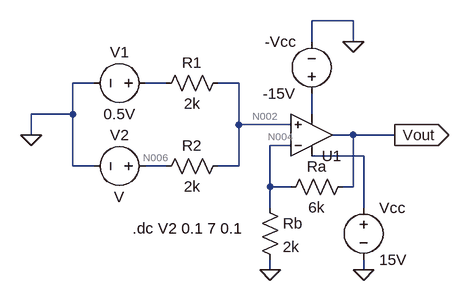
[diagram p0: schematic Q2.asc]
Q2.asc, the LTspice schematic file:
Version 4
SHEET 1 880 680
WIRE 256 -32 192 -32
WIRE 192 0 192 -32
WIRE 256 0 256 -32
WIRE -144 64 -176 64
WIRE -32 64 -64 64
WIRE 80 64 48 64
WIRE -176 112 -176 64
WIRE -176 112 -240 112
WIRE 192 112 192 80
WIRE 80 128 80 64
WIRE 160 128 80 128
WIRE -240 144 -240 112
WIRE 256 144 224 144
WIRE 320 144 256 144
WIRE 160 160 128 160
WIRE 272 176 192 176
WIRE -176 192 -176 112
WIRE -144 192 -176 192
WIRE -32 192 -64 192
WIRE 80 192 80 128
WIRE 80 192 48 192
WIRE 128 224 128 160
WIRE 160 224 128 224
WIRE 256 224 256 144
WIRE 256 224 240 224
WIRE 128 256 128 224
WIRE 272 256 272 176
WIRE 128 352 128 336
WIRE 272 352 272 336
FLAG 128 352 0
FLAG 256 0 0
FLAG 272 352 0
FLAG 320 144 Vout
IOPIN 320 144 Out
FLAG -240 144 0
SYMBOL Opamps\\UniversalOpamp2 192 144 M180
SYMATTR InstName U1
SYMBOL res 64 48 R90
WINDOW 0 0 56 VBottom 2
WINDOW 3 32 56 VTop 2
SYMATTR InstName R1
SYMATTR Value 2k
SYMBOL res 64 176 R90
WINDOW 0 0 56 VBottom 2
WINDOW 3 32 56 VTop 2
SYMATTR InstName R2
SYMATTR Value 2k
SYMBOL res 256 208 R90
WINDOW 0 0 56 VBottom 2
WINDOW 3 32 56 VTop 2
SYMATTR InstName Ra
SYMATTR Value 6k
SYMBOL res 112 240 R0
SYMATTR InstName Rb
SYMATTR Value 2k
SYMBOL voltage 192 96 R180
WINDOW 0 24 96 Left 2
WINDOW 3 24 16 Left 2
SYMATTR InstName -Vcc
SYMATTR Value -15V
SYMBOL voltage 272 240 R0
SYMATTR InstName Vcc
SYMATTR Value 15V
SYMBOL voltage -48 64 R90
WINDOW 0 -32 56 VBottom 2
WINDOW 3 32 56 VTop 2
WINDOW 123 0 0 Left 0
WINDOW 39 0 0 Left 0
SYMATTR InstName V1
SYMATTR Value 0.5V
SYMBOL voltage -48 192 R90
WINDOW 0 -32 56 VBottom 2
WINDOW 3 32 56 VTop 2
WINDOW 123 0 0 Left 0
WINDOW 39 0 0 Left 0
SYMATTR InstName V2
TEXT -84 288 Left 2 !.dc V2 0.1 7 0.1

The netlist it stands for:
* Q2.asc
XU1 N002 N004 N005 N003 Vout level.2 Avol=1Meg GBW=10Meg Slew=10Meg ilimit=25m rail=0 Vos=0 phimargin=45 en=0 enk=0 in=0 ink=0 Rin=500Meg  ; pins IN+ IN- V+ V- OUT
R1 N002 N001 2k
R2 N002 N006 2k
Ra Vout N004 6k
Rb N004 0 2k
V§-Vcc N003 0 -15V
Vcc N005 0 15V
V1 N001 0 0.5V
V2 N006 0 V
.dc V2 0.1 7 0.1
.lib UniversalOpamps2.sub
.backanno
.end

* Results of the author's LTspice run, read from the files saved beside the schematic
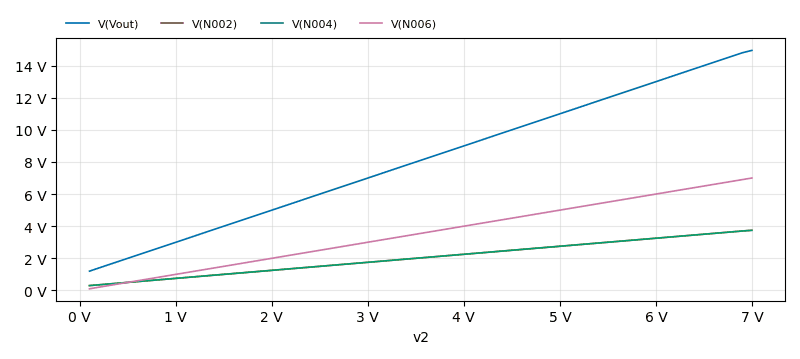
[diagram p1: DC transfer characteristic of Q2.asc, plotted from the saved traces]
* DC transfer characteristic, 1 run:
*   V(Vout): 1.2 V at v2=100 mV, 14.95 V at v2=7 V, min 1.2 V, max 14.95 V
*   V(N002): 300 mV at v2=100 mV, 3.75 V at v2=7 V, min 300 mV, max 3.75 V
*   V(N004): 300 mV at v2=100 mV, 3.737 V at v2=7 V, min 300 mV, max 3.737 V
*   V(N006): 100 mV at v2=100 mV, 7 V at v2=7 V, min 100 mV, max 7 V